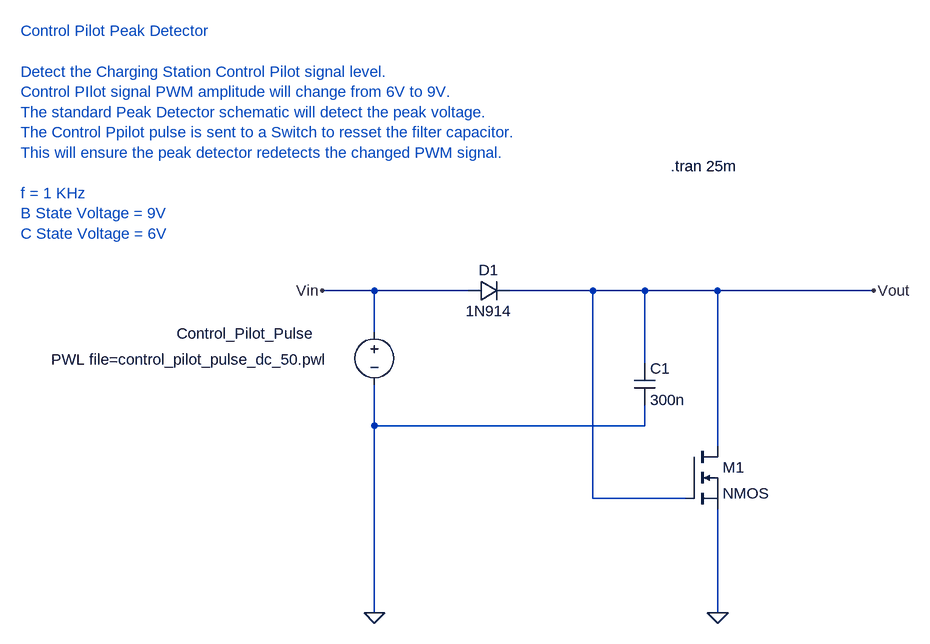
[diagram p0: schematic control_pilot_peak_detector.asc]
control_pilot_peak_detector.asc, the LTspice schematic file:
Version 4
SHEET 1 984 912
WIRE 144 336 64 336
WIRE 288 336 144 336
WIRE 480 336 352 336
WIRE 560 336 480 336
WIRE 672 336 560 336
WIRE 912 336 672 336
WIRE 144 400 144 336
WIRE 560 448 560 336
WIRE 144 544 144 480
WIRE 560 544 560 512
WIRE 560 544 144 544
WIRE 672 576 672 336
WIRE 480 656 480 336
WIRE 624 656 480 656
WIRE 144 832 144 544
WIRE 672 832 672 672
FLAG 144 832 0
FLAG 64 336 Vin
FLAG 672 832 0
FLAG 912 336 Vout
SYMBOL voltage 144 384 R0
WINDOW 3 -497 58 Left 2
WINDOW 123 0 0 Left 0
WINDOW 39 0 0 Left 0
WINDOW 0 -304 18 Left 2
SYMATTR Value PWL file=control_pilot_pulse_dc_50.pwl
SYMATTR InstName Control_Pilot_Pulse
SYMBOL diode 288 352 R270
WINDOW 0 32 32 VTop 2
WINDOW 3 0 32 VBottom 2
SYMATTR InstName D1
SYMATTR Value 1N914
SYMBOL cap 544 448 R0
SYMATTR InstName C1
SYMATTR Value 300n
SYMBOL nmos 624 576 R0
SYMATTR InstName M1
TEXT -400 -64 Left 2 ;Control Pilot Peak Detector\n \nDetect the Charging Station Control Pilot signal level.\nControl PIlot signal PWM amplitude will change from 6V to 9V.\nThe standard Peak Detector schematic will detect the peak voltage. \nThe Control Ppilot pulse is sent to a Switch to resset the filter capacitor.\nThis will ensure the peak detector redetects the changed PWM signal.\n \nf = 1 KHz\nB State Voltage = 9V\nC State Voltage = 6V
TEXT 600 144 Left 2 !.tran 25m

The netlist it stands for:
* control_pilot_peak_detector.asc
V§Control_Pilot_Pulse Vin 0 PWL file=control_pilot_pulse_dc_50.pwl
D1 Vin Vout 1N914
C1 Vout 0 300n
M1 Vout Vout 0 0 NMOS
.model D D
.lib standard.dio
.model NMOS NMOS
.model PMOS PMOS
.lib standard.mos
* Control Pilot Peak Detector
* Detect the Charging Station Control Pilot signal level.
* Control PIlot signal PWM amplitude will change from 6V to 9V.
* The standard Peak Detector schematic will detect the peak voltage.
* The Control Ppilot pulse is sent to a Switch to resset the filter capacitor.
* This will ensure the peak detector redetects the changed PWM signal.
* f = 1 KHz
* B State Voltage = 9V
* C State Voltage = 6V
.tran 25m
.backanno
.end